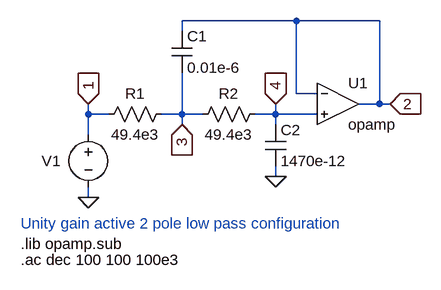
[diagram p0: schematic Unity_gain_2P_LPF.asc]
Unity_gain_2P_LPF.asc, the LTspice schematic file:
Version 4
SHEET 1 1784 776
WIRE 240 0 64 0
WIRE 368 0 240 0
WIRE 64 16 64 0
WIRE 240 112 240 0
WIRE 272 112 240 112
WIRE 368 128 368 0
WIRE 368 128 336 128
WIRE 384 128 368 128
WIRE -80 144 -80 128
WIRE -48 144 -80 144
WIRE 64 144 64 80
WIRE 64 144 32 144
WIRE 96 144 64 144
WIRE 208 144 208 128
WIRE 208 144 176 144
WIRE 272 144 208 144
WIRE 64 160 64 144
WIRE 208 160 208 144
WIRE -80 176 -80 144
WIRE 208 240 208 224
WIRE -80 272 -80 256
FLAG -80 272 0
FLAG -80 128 1
IOPIN -80 128 In
FLAG 64 160 3
IOPIN 64 160 In
FLAG 208 128 4
IOPIN 208 128 In
FLAG 384 128 2
IOPIN 384 128 In
FLAG 208 240 0
SYMBOL res 48 128 R90
WINDOW 0 0 56 VBottom 2
WINDOW 3 32 56 VTop 2
SYMATTR InstName R1
SYMATTR Value 49.4e3
SYMBOL OpAmps\\opamp 304 64 R0
SYMATTR InstName U1
SYMBOL voltage -80 160 R0
WINDOW 39 0 0 Left 0
WINDOW 3 40 63 Invisible 2
WINDOW 0 -72 56 Left 2
SYMATTR Value 1
SYMATTR InstName V1
SYMATTR Value2 AC 1
SYMBOL res 192 128 R90
WINDOW 0 0 56 VBottom 2
WINDOW 3 32 56 VTop 2
SYMATTR InstName R2
SYMATTR Value 49.4e3
SYMBOL cap 192 160 R0
SYMATTR InstName C2
SYMATTR Value 1470e-12
SYMBOL cap 48 16 R0
SYMATTR InstName C1
SYMATTR Value 0.01e-6
TEXT -184 312 Left 2 ;Unity gain active 2 pole low pass configuration
TEXT -184 344 Left 2 !.lib opamp.sub
TEXT -184 368 Left 2 !.ac dec 100 100 100e3

The netlist it stands for:
* Unity_gain_2P_LPF.asc
R1 3 1 49.4e3
XU1 2 4 2 opamp Aol=100K GBW=10Meg  ; pins invin noninvin out
V1 1 0 1 AC 1
R2 4 3 49.4e3
C2 4 0 1470e-12
C1 2 3 0.01e-6
* Unity gain active 2 pole low pass configuration
.lib opamp.sub
.ac dec 100 100 100e3
.backanno
.end